# Altium schematic sheet Optocoupler.SchDoc
size A3; SheetNumber: 6; SheetTotal: 6
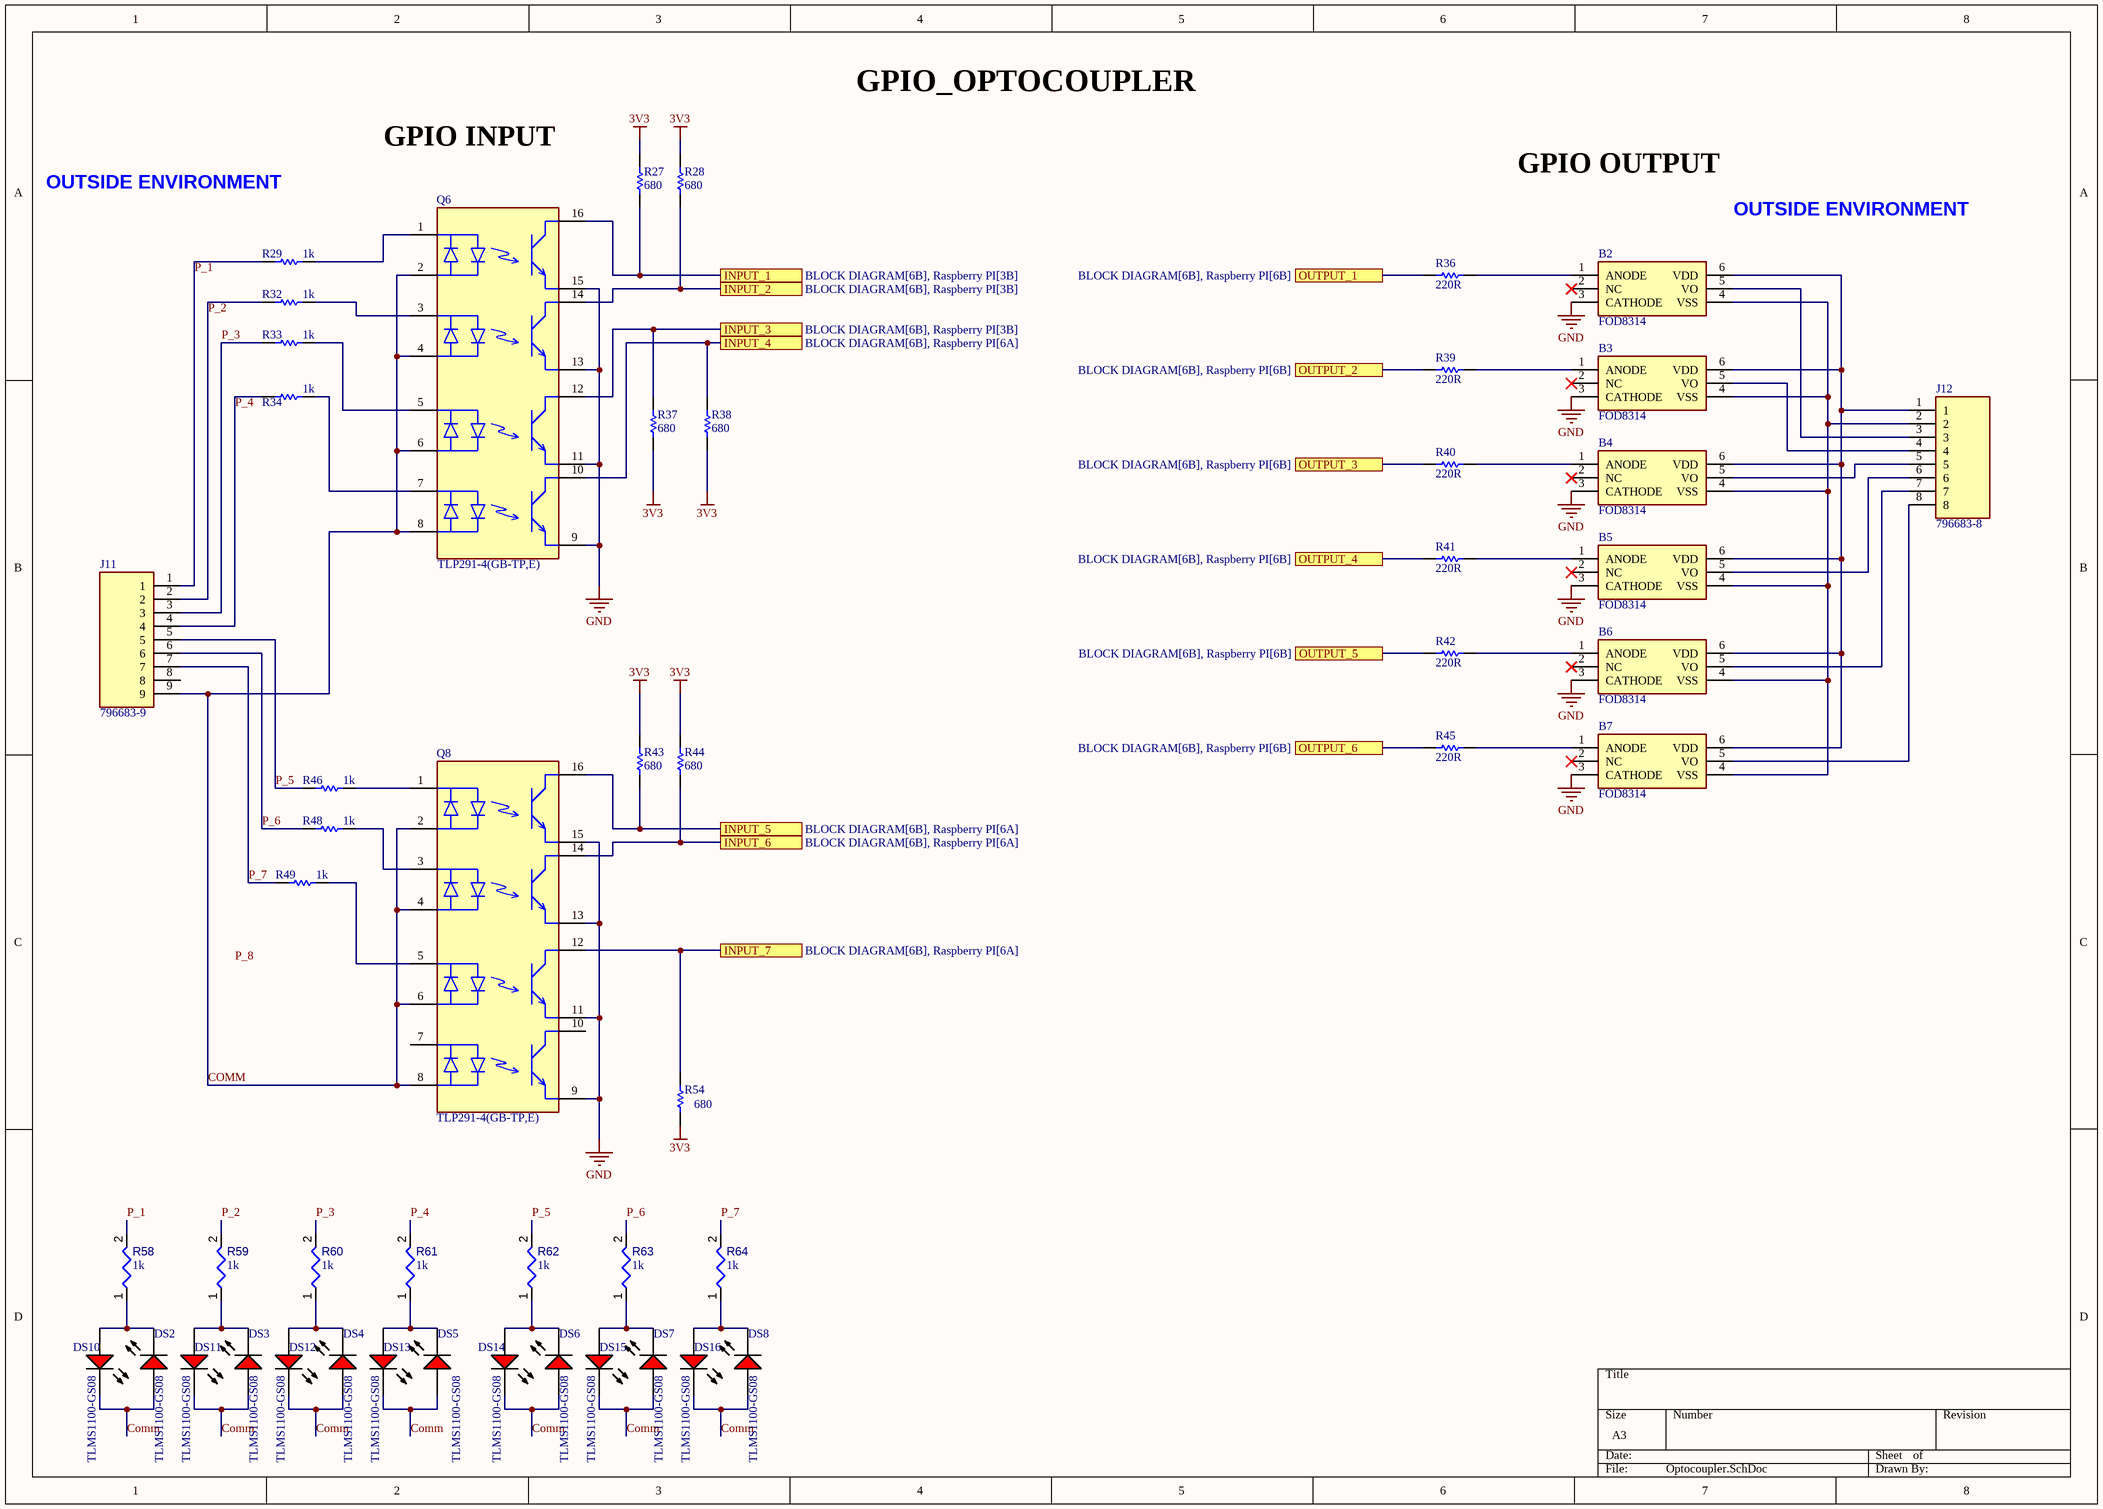
[diagram p0: Optocoupler.SchDoc]

## Parts
B2  FOD8314  [SOIC127P970X348-6N]
B3  FOD8314  [SOIC127P970X348-6N]
B4  FOD8314  [SOIC127P970X348-6N]
B5  FOD8314  [SOIC127P970X348-6N]
B6  FOD8314  [SOIC127P970X348-6N]
B7  FOD8314  [SOIC127P970X348-6N]
DS2  TLMS1100-GS08  [VISH-TLMX1100_V]
DS3  TLMS1100-GS08  [VISH-TLMX1100_V]
DS4  TLMS1100-GS08  [VISH-TLMX1100_V]
DS5  TLMS1100-GS08  [VISH-TLMX1100_V]
DS6  TLMS1100-GS08  [VISH-TLMX1100_V]
DS7  TLMS1100-GS08  [VISH-TLMX1100_V]
DS8  TLMS1100-GS08  [VISH-TLMX1100_V]
DS10  TLMS1100-GS08  [VISH-TLMX1100_V]
DS11  TLMS1100-GS08  [VISH-TLMX1100_V]
DS12  TLMS1100-GS08  [VISH-TLMX1100_V]
DS13  TLMS1100-GS08  [VISH-TLMX1100_V]
DS14  TLMS1100-GS08  [VISH-TLMX1100_V]
DS15  TLMS1100-GS08  [VISH-TLMX1100_V]
DS16  TLMS1100-GS08  [VISH-TLMX1100_V]
J11  796683-9  [TE_796683-9]
J12  796683-8  [TE_796683-8]
Q6  TLP291-4(GB-TP,E)  [FP-11-11F1-MFG]
Q8  TLP291-4(GB-TP,E)  [FP-11-11F1-MFG]
R27  value 680  [RESC3216X60X45ML15T20]  (hidden comment: RC1206JR-07680RL)
R28  value 680  [RESC3216X60X45ML15T20]  (hidden comment: RC1206JR-07680RL)
R29  value 1k  [RESC3216X60X45ML15T20]  (hidden comment: RC1206FR-071KL)
R32  value 1k  [RESC3216X60X45ML15T20]  (hidden comment: RC1206FR-071KL)
R33  value 1k  [RESC3216X60X45ML15T20]  (hidden comment: RC1206FR-071KL)
R34  value 1k  [RESC3216X60X45ML15T20]  (hidden comment: RC1206FR-071KL)
R36  220R  [RESC1608X55X25ML10T15]
R37  value 680  [RESC3216X60X45ML15T20]  (hidden comment: RC1206JR-07680RL)
R38  value 680  [RESC3216X60X45ML15T20]  (hidden comment: RC1206JR-07680RL)
R39  220R  [RESC1608X55X25ML10T15]
R40  220R  [RESC1608X55X25ML10T15]
R41  220R  [RESC1608X55X25ML10T15]
R42  220R  [RESC1608X55X25ML10T15]
R43  value 680  [RESC3216X60X45ML15T20]  (hidden comment: RC1206JR-07680RL)
R44  value 680  [RESC3216X60X45ML15T20]  (hidden comment: RC1206JR-07680RL)
R45  220R  [RESC1608X55X25ML10T15]
R46  value 1k  [RESC3216X60X45ML15T20]  (hidden comment: RC1206FR-071KL)
R48  value 1k  [RESC3216X60X45ML15T20]  (hidden comment: RC1206FR-071KL)
R49  value 1k  [RESC3216X60X45ML15T20]  (hidden comment: RC1206FR-071KL)
R54  value 680  [RESC3216X60X45ML15T20]  (hidden comment: RC1206JR-07680RL)
R58  value 1k  [RESC1608X55X25ML10T15]  (hidden comment: Resistor 1k +/-1% 0603 100 mW)
R59  value 1k  [RESC1608X55X25ML10T15]  (hidden comment: Resistor 1k +/-1% 0603 100 mW)
R60  value 1k  [RESC1608X55X25ML10T15]  (hidden comment: Resistor 1k +/-1% 0603 100 mW)
R61  value 1k  [RESC1608X55X25ML10T15]  (hidden comment: Resistor 1k +/-1% 0603 100 mW)
R62  value 1k  [RESC1608X55X25ML10T15]  (hidden comment: Resistor 1k +/-1% 0603 100 mW)
R63  value 1k  [RESC1608X55X25ML10T15]  (hidden comment: Resistor 1k +/-1% 0603 100 mW)
R64  value 1k  [RESC1608X55X25ML10T15]  (hidden comment: Resistor 1k +/-1% 0603 100 mW)

## Ports
INPUT_1 (see BLOCK DIAGRAM[6B], Raspberry PI[3B]), INPUT_2 (see BLOCK DIAGRAM[6B], Raspberry PI[3B]), INPUT_3 (see BLOCK DIAGRAM[6B], Raspberry PI[3B]), INPUT_4 (see BLOCK DIAGRAM[6B], Raspberry PI[6A]), INPUT_5 (see BLOCK DIAGRAM[6B], Raspberry PI[6A]), INPUT_6 (see BLOCK DIAGRAM[6B], Raspberry PI[6A]), INPUT_7 (see BLOCK DIAGRAM[6B], Raspberry PI[6A]), OUTPUT_1 (see BLOCK DIAGRAM[6B], Raspberry PI[6B]), OUTPUT_2 (see BLOCK DIAGRAM[6B], Raspberry PI[6B]), OUTPUT_3 (see BLOCK DIAGRAM[6B], Raspberry PI[6B]), OUTPUT_4 (see BLOCK DIAGRAM[6B], Raspberry PI[6B]), OUTPUT_5 (see BLOCK DIAGRAM[6B], Raspberry PI[6B]), OUTPUT_6 (see BLOCK DIAGRAM[6B], Raspberry PI[6B])

## Nets
3V3: R27.1 R28.1 R37.2 R38.2 R43.1 R44.1 R54.2
GND: B2.3(CATHODE) B3.3(CATHODE) B4.3(CATHODE) B5.3(CATHODE) B6.3(CATHODE) B7.3(CATHODE) Q6.9(E) Q6.11(E) Q6.13(E) Q6.15(E) Q8.9(E) Q8.11(E) Q8.13(E) Q8.15(E)
COMM: DS2.1(A) DS3.1(A) DS4.1(A) DS5.1(A) DS6.1(A) DS7.1(A) DS8.1(A) DS10.2(K) DS11.2(K) DS12.2(K) DS13.2(K) DS14.2(K) DS15.2(K) DS16.2(K) J11.9 Q6.2(1_Anode/Cathode) Q6.4(2_Anode/Cathode) Q6.6(3_Anode/Cathode) Q6.8(4_Anode/Cathode) Q8.2(1_Anode/Cathode) Q8.4(2_Anode/Cathode) Q8.6(3_Anode/Cathode) Q8.8(4_Anode/Cathode)
INPUT_1: Q6.16(C) R27.2 ; port INPUT_1
INPUT_2: Q6.14(C) R28.2 ; port INPUT_2
INPUT_3: Q6.12(C) R37.1 ; port INPUT_3
INPUT_4: Q6.10(C) R38.1 ; port INPUT_4
INPUT_5: Q8.16(C) R43.2 ; port INPUT_5
INPUT_6: Q8.14(C) R44.2 ; port INPUT_6
INPUT_7: Q8.12(C) R54.1 ; port INPUT_7
OUTPUT_1: R36.1 ; port OUTPUT_1
OUTPUT_2: R39.1 ; port OUTPUT_2
OUTPUT_3: R40.1 ; port OUTPUT_3
OUTPUT_4: R41.1 ; port OUTPUT_4
OUTPUT_5: R42.1 ; port OUTPUT_5
OUTPUT_6: R45.1 ; port OUTPUT_6
P_1: J11.1 R29.2 R58.2
P_2: J11.2 R32.2 R59.2
P_3: J11.3 R33.2 R60.2
P_4: J11.4 R34.2 R61.2
P_5: J11.5 R46.2 R62.2
P_6: J11.6 R48.2 R63.2
P_7: J11.7 R49.2 R64.2
NetB2_1: B2.1(ANODE) R36.2
NetB2_4: B2.4(VSS) B3.4(VSS) B4.4(VSS) B5.4(VSS) B6.4(VSS) B7.4(VSS) J12.2
NetB2_5: B2.5(VO) J12.3
NetB2_6: B2.6(VDD) B3.6(VDD) B4.6(VDD) B5.6(VDD) B6.6(VDD) B7.6(VDD) J12.1
NetB3_1: B3.1(ANODE) R39.2
NetB3_5: B3.5(VO) J12.4
NetB4_1: B4.1(ANODE) R40.2
NetB4_5: B4.5(VO) J12.5
NetB5_1: B5.1(ANODE) R41.2
NetB5_5: B5.5(VO) J12.6
NetB6_1: B6.1(ANODE) R42.2
NetB6_5: B6.5(VO) J12.7
NetB7_1: B7.1(ANODE) R45.2
NetB7_5: B7.5(VO) J12.8
NetDS2_2: DS2.2(K) DS10.1(A) R58.1
NetDS3_2: DS3.2(K) DS11.1(A) R59.1
NetDS4_2: DS4.2(K) DS12.1(A) R60.1
NetDS5_2: DS5.2(K) DS13.1(A) R61.1
NetDS6_2: DS6.2(K) DS14.1(A) R62.1
NetDS7_2: DS7.2(K) DS15.1(A) R63.1
NetDS8_2: DS8.2(K) DS16.1(A) R64.1
NetQ6_1: Q6.1(1_Cathode/Anode) R29.1
NetQ6_3: Q6.3(2_Cathode/Anode) R32.1
NetQ6_5: Q6.5(3_Cathode/Anode) R33.1
NetQ6_7: Q6.7(4_Cathode/Anode) R34.1
NetQ8_1: Q8.1(1_Cathode/Anode) R46.1
NetQ8_3: Q8.3(2_Cathode/Anode) R48.1
NetQ8_5: Q8.5(3_Cathode/Anode) R49.1

Not connected (* = marked no-connect by the designer): B2 2(NC)*; B3 2(NC)*; B4 2(NC)*; B5 2(NC)*; B6 2(NC)*; B7 2(NC)*; J11 8; Q8 7(4_Cathode/Anode) 10(C)

## Notes on the sheet
- GPIO_OPTOCOUPLER
- GPIO INPUT
- GPIO OUTPUT
- OUTSIDE ENVIRONMENT
- Labels drawn without touching a wire or pin: P_8

## Library data of the parts
B2-B7 = FOD8314: Logic Output Optocouplers 1.0A Output Gate Driver Optocoupler; Manufacturer_Name: onsemi; Geometry.Height: 3.48mm; Manufacturer_Part_Number: FOD8314; Mouser Part Number: 512-FOD8314; Mouser Price/Stock: https://www.mouser.com/Search/Refine.aspx?Keyword=512-FOD8314; Arrow Part Number: FOD8314; Arrow Price/Stock: https://www.arrow.com/en/products/fod8314/on-semiconductor?region=nac; Datasheet Link: https://componentsearchengine.com/Datasheets/1/FOD8314.pdf
DS2-DS8 DS10-DS16 = CMP-007-00030-2: Red Led, 20mA, 2.1 V, -40 to 100 degC, 2-Pin SMD (0603), RoHS, Tape and Reel; Manufacturer: Vishay Semiconductor; Viewing Angle: 160degrees; Forward Voltage: 2.1V; Lens Style: Clear; Power: 90mW; Luminous Intensity: 63mcd; Datasheet Version: Rev. 2.7, 03/2016; Package Quantity: 3000; Colour: Red; Package Description: 2-Pin Surface Mount Device, Body 1.6 x 0.8 mm; Datasheet URL: http://www.vishay.com/docs/83173/tlmb1100.pdf; Package Reference: TLMX1100; Max Operating Temperature: 100°C; Mounting Technology: SM; Packaging: TapeandReel; Case/Package: 0603; Illumination Colour: Red; Forward Current: 20mA; Manufacturer URL: http://www.vishay.com/; RoHS Compliant: True; Min Operating Temperature: -40°C; Nominal Vf: 2.1V; Pins: 2
J11 = 796683-9: 9 Position Wire to Board Terminal Block Horizontal with Board 0.197 (5.00mm) Through Hole; MF: TE Connectivity; MP: 796683-9; DigiKey-Purchase-URL: https://snapeda.com/shop?store=DigiKey&id=2387175; Package: None; EU_RoHS_Compliance: Compliant with Exemptions; Price: None; Value: *; SnapEDA_Link: https://www.snapeda.com/parts/796683-9/TE%20Connectivity/view-part/2387175/?ref=snap; Availability: Warning; Check_prices: https://www.snapeda.com/parts/796683-9/TE%20Connectivity/view-part/2387175/?ref=eda
Q6 Q8 = CMP-35887-000006-1: OPTOISOLTR 2.5KV 4CH TRANS 16-SO; Manufacturer: Toshiba; Manufacturer Part Number: TLP290-4(TP,E; Emiiter Collector Voltage: 7V; Min Current Transfer Ratio: 50%; Forward Voltage: 1.2V; Standoff Height: 0.1mm; Turn Off Delay Time: 3us; Isolation Voltage: 2500Vrms; Forward Current: 10mA; Max Current Transfer Ratio: 400%; Max Junction Temp: +125°C; Collector Emitter Voltage: 80V; Device Class L3: unset; Octopart: https://octopart.com/tlp290-4%28tp%2Ce-toshiba-33727646; Device Class L2: Optocouplers; Digikey Description: OPTOISOLTR 2.5KV 4CH TRANS 16-SO; Height: 2.3mm; RoHS: TRUE; Mouser Description: Transistor Output Optocouplers X36 PBF Transistor Couplr ACInput 110C; Temperature: -55°C to +110°C; Temperature Range Low: -55°C; Ambient Temperature Range Low: -55°C; ComponentLink2Description: Datasheet; Ambient Temperature Range High: +110°C; Automotive: No; Device Class L1: Optoelectronics; Temperature Range High: +110°C; Footprint Url: https://toshiba.semicon-storage.com/us/design-support/package/detail.SO16.html; Turn On Delay Time: 3us; Lead Free: Yes; ComponentLink2URL: https://toshiba.semicon-storage.com/info/docget.jsp?did=12855&prodName=TLP290-4; Package: 11-11F1; Category: Trans
R27-R29 R32-R34 R37 R38 R43 R44 R46 R48 R49 R54 = CMP-009-00002-5: Chip Resistor, 0 Ohm, +/- 5%, 0.25 W, -55 to 155 degC, 1206 (3216 Metric); Voltage Rating: 200V; Power: 250mW; Tolerance: 5%; Min Operating Temperature: -55°C; Mounting Technology: SM; Max Operating Temperature: 155°C; Case/Package: 1206; RoHS Compliant: True; Pins: 2
R36 R39-R42 R45 = CMP-1659-00018-2: General Purpose Chip Resistors, 220 Ohm, +/- 1%, -55 to 155 degC, 0603 (1608 Metric), RoHS, Tape and Reel; RoHSCompliant: false; DatasheetVersion: Rev. 4, 04/2009; ComponentLink2Description: Datasheet; ComponentLink2URL: https://datasheet.ciiva.com/11808/0900766b80f96399-11808136.pdf; ComponentLink1URL: http://www.yageo.com/; ComponentLink1Description: Manufacturer URL; PackageReference: 0603; PackageDescription: 2-Pin Surface Mount Device, Body 1.6 x 0.8 mm
R58-R64 = CMP-009-00014-5: Chip Resistor, 1 KOhm, +/-1%, 0.1 W, -55 to 155 degC, 0603 (1608 Metric); Voltage Rating: 50V; Power: 100mW; Tolerance: 1%; Mounting Technology: SM; Pins: 2; Case/Package: 0603; Min Operating Temperature: -55°C; RoHS Compliant: True; Max Operating Temperature: 155°C
J12 = 796683-8: Package: None; Price: None; Value: *; MP: 796683-8; Availability: Unavailable